# EAGLE design BEL PINTU NADA (EAGLE 9.6.2)
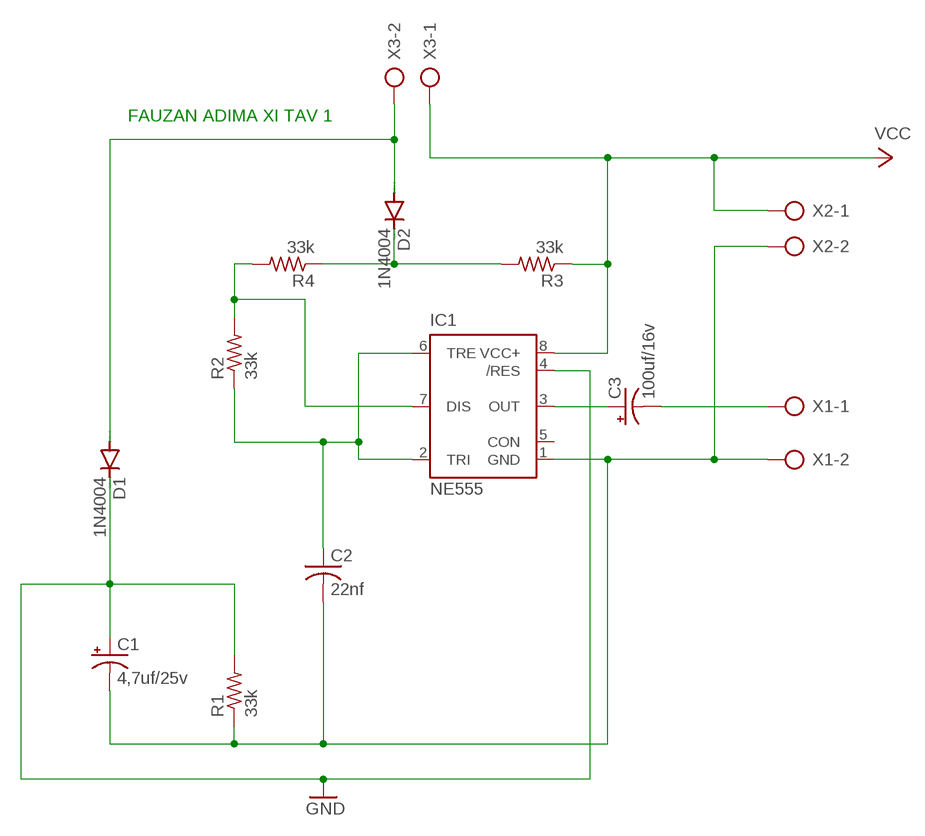
[diagram p0: schematic, sheet 1]

## Parts
C1  4,7uf/25v  CPOL-USE2-4  [E2-4]
C2  22nf  C-US025-025X050  [C025-025X050]
C3  100uf/16v  CPOL-USE2-4  [E2-4]
D1  1N4004  [DO41-10]
D2  1N4004  [DO41-10]
IC1  NE555  [DIL-08]
R1  33k  R-US_0309/12  [0309/12]
R2  33k  R-US_0309/12  [0309/12]
R3  33k  R-US_0309/12  [0309/12]
R4  33k  R-US_0309/12  [0309/12]
X1  AK300/2  [AK300/2]
X2  AK300/2  [AK300/2]
X3  AK300/2  [AK300/2]

## Nets
GND: C1.+ D1.C IC1.4(/RES) R1.2
N$1: C3.+ IC1.3(OUT)
N$2: C3.- X1.1
N$3: C1.- C2.2 IC1.1(GND) R1.1 X1.2 X2.2
N$4: D2.C R3.2 R4.1
N$5: D1.A D2.A X3.2
N$6: IC1.7(DIS) R2.2 R4.2
N$7: C2.1 IC1.2(TRI) IC1.6(TRE) R2.1
VCC: IC1.8(VCC+) R3.1 X2.1 X3.1
Unconnected: IC1.5(CON)

## Notes on the sheet
- FAUZAN ADIMA XI TAV 1

## Library data of the parts
C1 C3 = rcl:CPOL-US: POLARIZED CAPACITOR, American symbol; SPICEPREFIX: C
C2 = rcl:C-US: CAPACITOR, American symbol; SPICEPREFIX: C
D1 D2 = diode:1N4004: DIODE general purpose rectifier, 1 A
IC1 = st-microelectronics:NE555: General purpose bipolar Timer; MF: Arrow Electronics; MPN: NE555N; OC_FARNELL: 1467742; OC_NEWARK: 89K1486
R1-R4 = rcl:R-US_: RESISTOR, American symbol; SPICEPREFIX: R
X1-X3 = con-ptr500:AK300/2: CONNECTOR; OC_FARNELL: unknown; OC_NEWARK: unknown

## Board
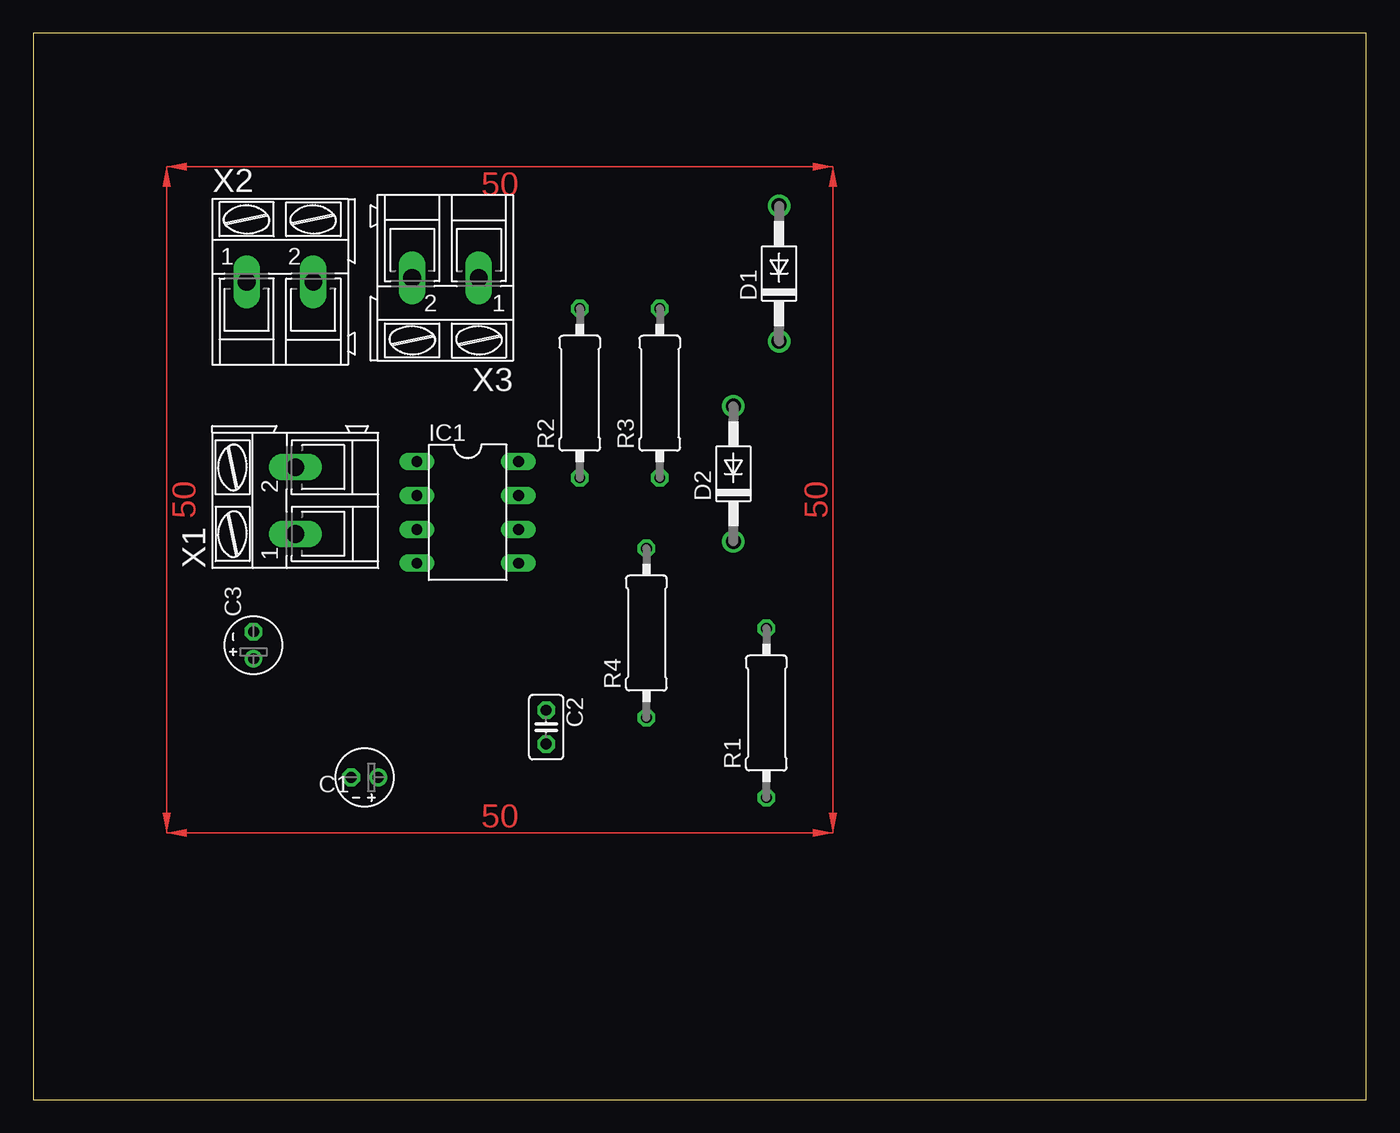
[diagram p1: board, top side]
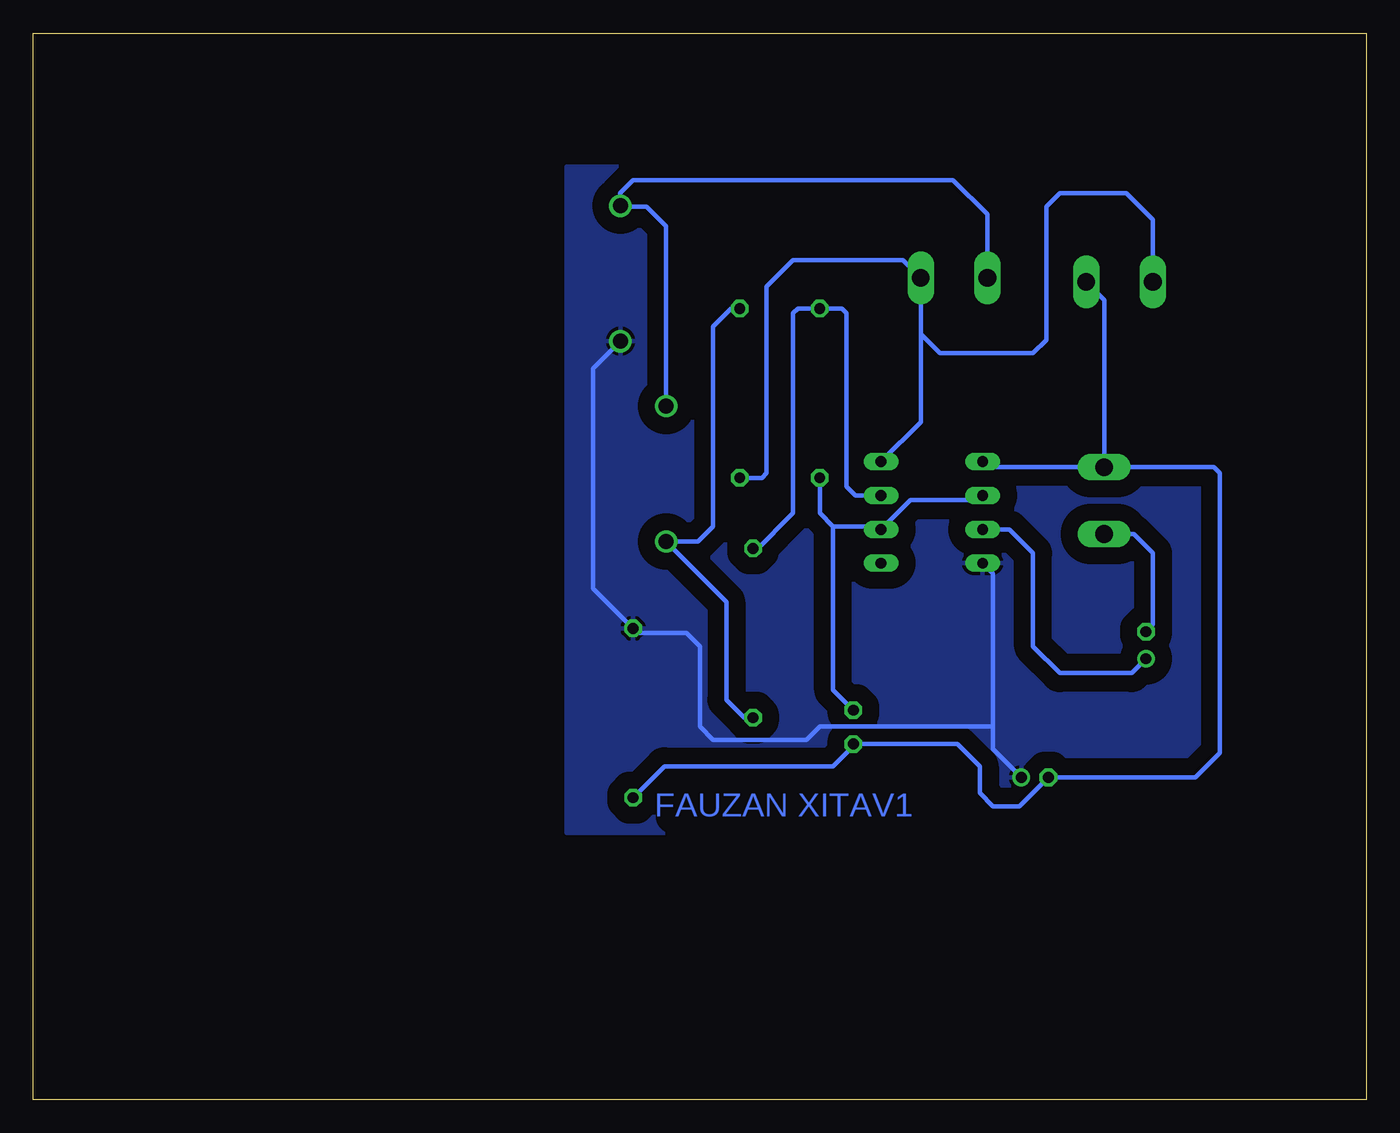
[diagram p2: board, bottom side, seen from below]

Size 100 x 80 mm. Coordinates in mm from the lower left corner, seen from the top.
Outline: 0,0 100,0 100,80 0,80 0,0
Copper layers (1*16): Top 0.035mm / dielectric 1.5mm / Bottom 0.035mm
Design rules "default *": minimum track width 6mil, minimum drill 0.35mm, track to track 50mil, track to pad 50mil, pad to pad 50mil, via to via 50mil, smd to smd 6mil, copper to edge 40mil, drill to drill 6mil, minimum pad ring 10mil, minimum via ring 8mil, stop-mask expansion 4mil, vias tented up to drill 0mil, thermal gap 10mil

### Footprints (pad centres in the part's own frame; a part is rotated, then mirrored left to right if it is on the bottom)
E2-4 = drill 0.813 pad 1.27: + -1.016,0 | drill 0.813 pad 1.27 octagon: - 1.016,0
C025-025X050 = drill 0.813 octagon: 1 -1.27,0; 2 1.27,0
DO41-10 = drill 1.118: A 5.08,0; C -5.08,0
DIL-08 = drill 0.813 long: 1 -3.81,-3.81; 2 -1.27,-3.81; 3 1.27,-3.81; 4 3.81,-3.81; 5 3.81,3.81; 6 1.27,3.81; 7 -1.27,3.81; 8 -3.81,3.81
0309/12 = drill 0.813 octagon: 1 -6.35,0; 2 6.35,0
AK300/2 = drill 1.321 long: 1 -2.515,0; 2 2.489,0

### Placement (x,y rotation side)
C1  24.86,24.17 180 top
C2  38.48,27.94 270 top
C3  16.52,34.09 90 top
D1  55.95,61.98 90 top
D2  52.52,46.95 90 top
IC1  32.59,44.05 270 top
R1  55,29 90 top
R2  41,53 90 top
R3  47,53 90 top
R4  46,35 90 top
X1  19.65,44.95 90 top
X2  18.52,61.35 0 top
X3  30.91,61.65 180 top

### Tracks (layer width: path | path; a pad name or v marks a point on that pad's centre or on a via)
GND
  Bottom 0.32: D1.C 58,54.85 58,38.35 R1.2 54.65,35 51,35 50,34 50,28 49,27 42,27 41,28 28,28 | IC1.4 28,39.46 28,28 | C1.+ 28,26.29 28,28
  pour Bottom: 10,70 10,20 60,20 60,70
N$1
  Bottom 0.32: C3.+ 17.59,32 23,32 25,34 25,41 26.78,42.78 IC1.3
N$2
  Bottom 0.32: X1.1 17.43,42.44 16,41 16,35.63 C3.-
N$3
  Bottom 0.32: X1.2 19.65,59.99 X2.2 | X1.2 28.36,47.44 IC1.1 | X1.2 11.44,47.44 11,47 11,26 12.83,24.17 C1.- 26.01,22 28,22 29,23 29,25 30.67,26.67 C2.2 38.48,26.52 40,25 52.65,25 R1.1
N$4
  Bottom 0.32: R3.2 47.65,59.35 49,58 49,43 50.13,41.87 D2.C 48,37.35 48,30 46.65,28.65 R4.1
N$5
  Bottom 0.32: X3.2 28.42,66.42 31,69 55,69 56,68 56,67.11 D1.A 55.89,67 54,67 52.52,65.52 D2.A
N$6
  Bottom 0.32: IC1.7 38.32,45.32 39,46 39,59 39.35,59.35 R2.2 42.65,59.35 43,59 43,44 45.83,41.17 | 45.65,41 45.83,41.17 | 45.83,41.17 R4.2
N$7
  Bottom 0.32: IC1.2 29.1,45 34.18,45 IC1.6 36.62,43 40,43 | R2.1 41,44 40,43 | C2.1 40,30.73 40,43
VCC
  Top 0.152: X2.1 16,61.01 16,61
  Bottom 0.32: X2.1 16,66 18,68 23,68 24,67 24,57 25,56 32,56 33.42,57.42 X3.1 | X3.1 33.42,50.84 IC1.8 | X3.1 34.77,63 43,63 45,61 45,47 45.35,46.65 R3.1
(copper drawn outside any net)
  shapes: Top area x4

### Text on the board
Bottom: FAUZAN XITAV1